# EAGLE schematic FED_detector_motor (EAGLE 5.11)
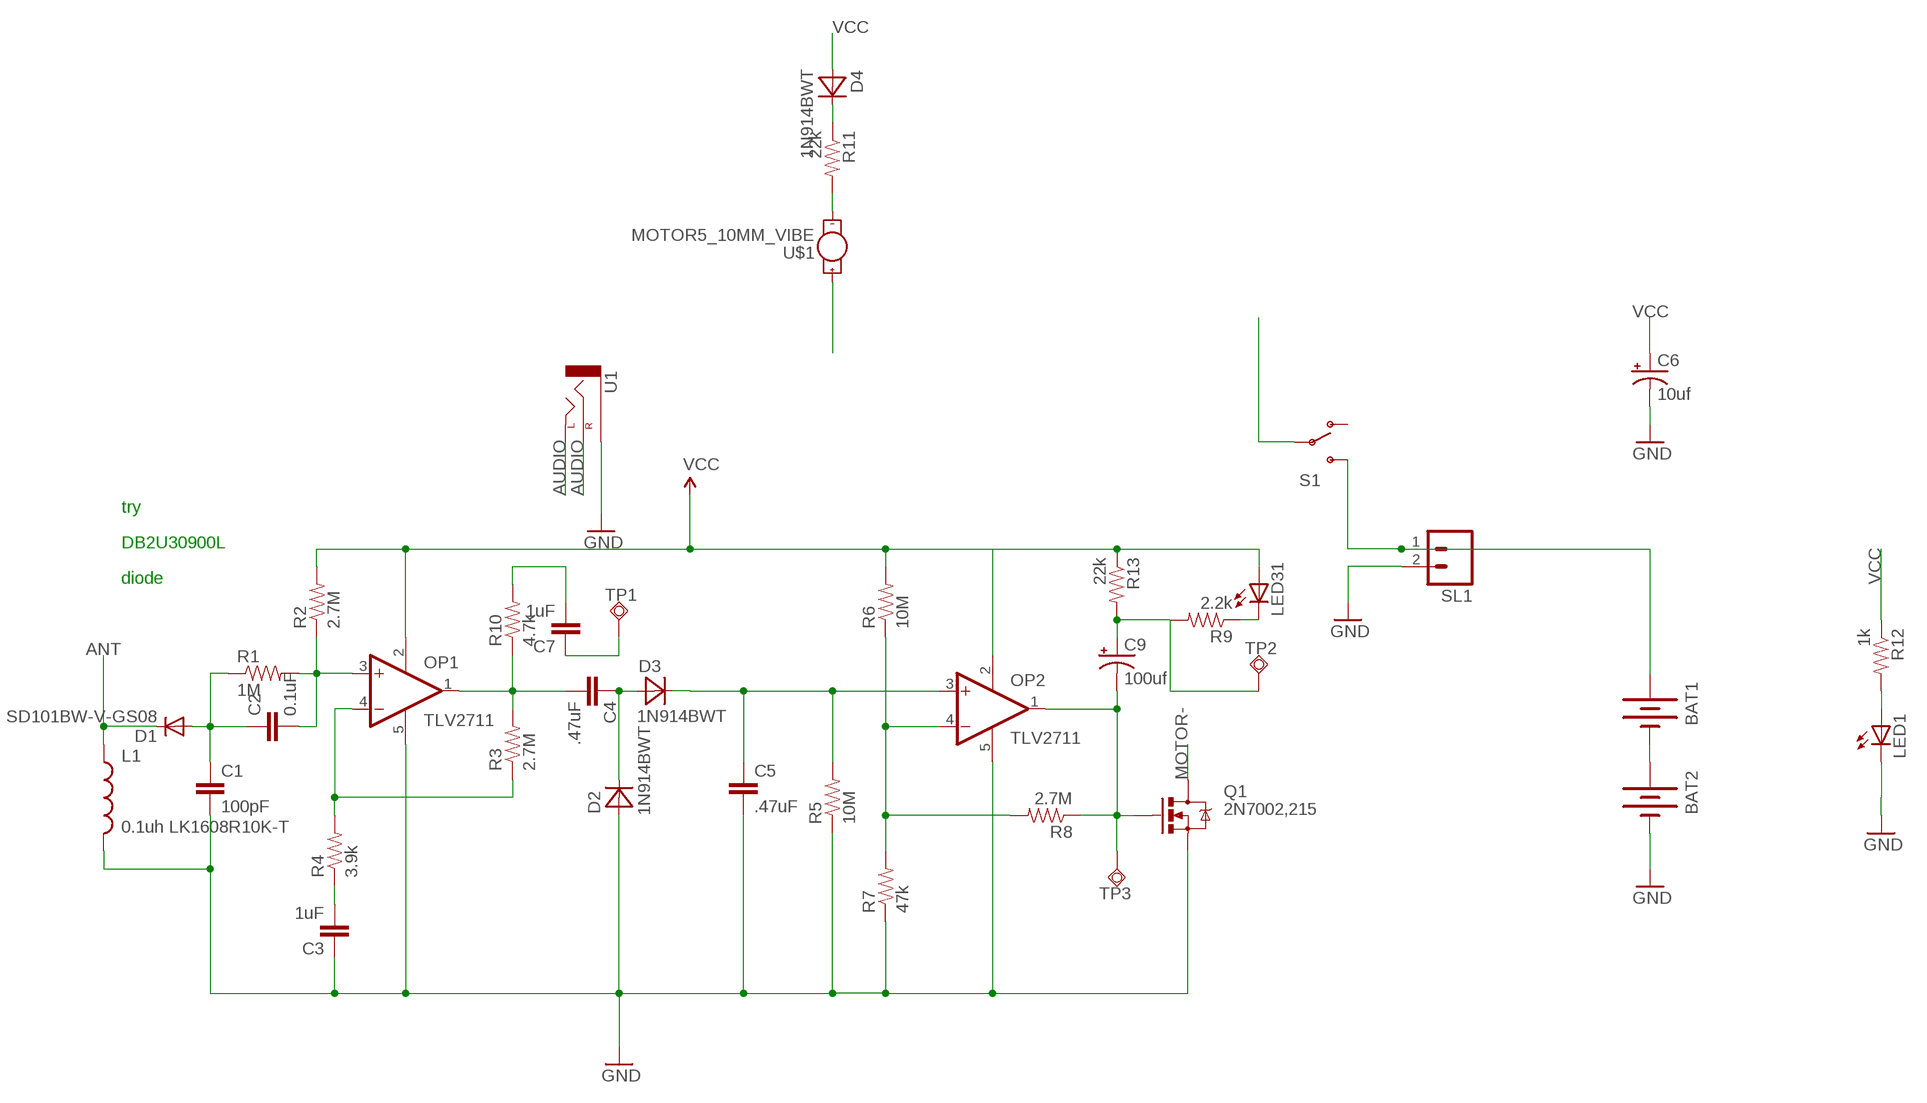
[diagram p0: schematic, sheet 1]

## Parts
BAT1  BATTERY245MM  [BATTCON_245MM]
BAT2  BATTERY245MM  [BATTCON_245MM]
C1  100pF  CAP0805  [0805]
C2  0.1uF  CAP0805  [0805]
C3  1uF  CAP0805  [0805]
C4  .47uF  CAP0805  [0805]
C5  .47uF  CAP0805  [0805]
C6  10uf  CAP_POLD  [PANASONIC_D]
C7  1uF  CAP0805  [0805]
C9  100uf  CAP_POL7343  [EIA7343]
D1  SD101BW-V-GS08  DIODE-SOD123  [SOD123]
D2  1N914BWT  [SOD-523F]
D3  1N914BWT  [SOD-523F]
D4  1N914BWT  [SOD-523F]
L1  0.1uh LK1608R10K-T  INDUCTOR0603  [0603]
LED1  LEDCHIPLED_1206  [CHIPLED_1206]
LED31  LEDCHIPLED_1206  [CHIPLED_1206]
OP1  TLV2711  [SOT23-5]
OP2  TLV2711  [SOT23-5]
Q1  2N7002,215  MOSFET-NCHANNELSMD  [SOT23-3]
R1  1M  RESISTOR0805-RES  [0805]
R2  2.7M  RESISTOR0805-RES  [0805]
R3  2.7M  RESISTOR0805-RES  [0805]
R4  3.9k  RESISTOR0805-RES  [0805]
R5  10M  RESISTOR0805-RES  [0805]
R6  10M  RESISTOR0805-RES  [0805]
R7  47k  RESISTOR0805-RES  [0805]
R8  2.7M  RESISTOR0805-RES  [0805]
R9  2.2k  RESISTOR0805-RES  [0805]
R10  4.7k  RESISTOR0805-RES  [0805]
R11  22k  RESISTOR0805-RES  [0805]
R12  1k  RESISTOR0805-RES  [0805]
R13  22k  RESISTOR0805-RES  [0805]
S1  SWITCH-SPST-SMD-A  [SWITCH-SPST-SMD-A]
SL1  M02  [02P]
TP1  TPSQTP20SQ  [TP20SQ]
TP2  TPSQTP20SQ  [TP20SQ]
TP3  TPSQTP20SQ  [TP20SQ]
U1  AUDIO-JACKSMD2  [AUDIO-JACK-3.5MM-SMD]
U$1  MOTOR5_10MM_VIBE  [5X10MM_VIB_MOTOR]

## Nets
ANT: D1.C L1.1
AUDIO: C7.1 TP1.TP U1.RING(RIGHT) U1.TIP(LEFT)
GND: BAT2.2(-) C1.2 C3.1 C5.2 C6.- D2.2(A) L1.2 LED1.C OP1.5(V-) OP2.5(V-) Q1.2(S) R5.1 R7.1 SL1.2 U1.SLEEVE
MOTOR-: Q1.3(D) U$1.P$1(+)
N$1: C1.1 C2.1 D1.A R1.1
N$2: C4.1 D2.1(C) D3.2(A)
N$3: C9.A(+) R9.2 R13.2 TP2.TP
N$4: C2.2 OP1.3(+IN) R1.2 R2.1
N$5: C5.1 D3.1(C) OP2.3(+IN) R5.2
N$6: C7.2 R10.2
N$7: OP1.4(-IN) R3.1 R4.2
N$8: C4.2 OP1.1(OUT) R3.2 R10.1
N$9: C3.2 R4.1
N$10: OP2.4(-IN) R6.1 R7.2 R8.2
N$12: D4.1(C) R11.1
N$13: C9.C(-) OP2.1(OUT) Q1.1(G) R8.1 TP3.TP
N$14: LED31.C R9.1
N$19: R11.2 U$1.P$2(-)
N$20: BAT1.2(-) BAT2.1(+)
N$21: BAT1.1(+) S1.3(S) SL1.1
N$24: LED1.A R12.2
VCC: C6.+ D4.2(A) LED31.A OP1.2(V+) OP2.2(V+) R2.2 R6.2 R12.1 R13.1 S1.2(P)
Unconnected: S1.1(O)

## Notes on the sheet
- try
- DB2U30900L
- diode

## Library data of the parts
BAT1 BAT2 = SparkFun:BATTERY: Battery Holders Various common sizes : AA, AAA, 20mm coin cell and 12mm coin cell.
C1-C5 C7 = SparkFun:CAP: Capacitor Standard 0603 ceramic capacitor, and 0.1" leaded capacitor.
C6 C9 = SparkFun:CAP_POL: Capacitor Polarized These are standard SMD and PTH capacitors. Normally 10uF, 47uF, and 100uF in electrolytic and tantalum varieties. Always verify the external diameter of the through hole cap, it varies with capacity, voltage, and manufacturer. The EIA devices should be standard.
D1 = diode:DIODE-: DIODE
D2-D4 = FED_detector:1N914BWT
L1 = SparkFun:INDUCTOR: Inductors Basic Inductor/Choke - 0603 and 1206. Footprints are not proven and vary greatly between part numbers.
LED1 LED31 = FED_detector:LED: LED OSRAM: - CHIPLED LG R971, LG N971, LY N971, LG Q971, LY Q971, LO R971, LY R971 LH N974, LH R974 LS Q976, LO Q976, LY Q976 LO Q996 - Hyper CHIPLED LW Q18S LB Q993, LB Q99A, LB R99A - SideLED LS A670, LO A670, LY A670, LG A670, LP A670 LB A673, LV A673, LT A673, LW A673 LH A674 LY A675 LS A676, LA A676, LO A676, LY A676, LW A676 LS A679, LY A679, LG A679 - Hyper Micro SIDELED® LS Y876, LA Y876, LO Y876, LY Y876 LT Y87S - SmartLED LW L88C, LW L88S LB L89C, LB L89S, LG L890 LS L89K, LO L89K, LY L89K LS L896, LA L896, LO L896, LY L896 - TOPLED LS T670, LO T670, LY T670, LG T670, LP T670 LSG T670, LSP T670, LSY T670, LOP T670, LYG T670 LG T671, LOG T671, LSG T671 LB T673, LV T673, LT T673, LW T673 LH T674 LS T676, LA T676, LO T676, LY T676, LB T676, LH T676, LSB T676, LW T676 LB T67C, LV T67C, LT T67C, LS T67K, LO T67K, LY T67K, LW E67C LS E67B, LA E67B, LO E67B, LY E67B, LB E67C, LV E67C, LT E67C LW T67C LS T679, LY T679, LG T679 LS T770, LO T770, LY T770, LG T770, LP T770 LB T773, LV T773, LT T773, LW T773 LH T774 LS E675, LA E675, LY E675, LS T675 LS T776, LA T776, LO T776, LY T776, LB T776 LHGB T686 LT T68C, LB T68C - Hyper Mini TOPLED® LB M676 - Mini TOPLED Santana® LG M470 LS M47K, LO M47K, LY M47K Source: http://www.osram.convergy.de LUXEON: - LUMILED® LXK2-PW12-R00, LXK2-PW12-S00, LXK2-PW14-U00, LXK2-PW14-V00 LXK2-PM12-R00, LXK2-PM12-S00, LXK2-PM14-U00 LXK2-PE12-Q00, LXK2-PE12-R00, LXK2-PE12-S00, LXK2-PE14-T00, LXK2-PE14-U00 LXK2-PB12-K00, LXK2-PB12-L00, LXK2-PB12-M00, LXK2-PB14-N00, LXK2-PB14-P00, LXK2-PB14-Q00 LXK2-PR12-L00, LXK2-PR12-M00, LXK2-PR14-Q00, LXK2-PR14-R00 LXK2-PD12-Q00, LXK2-PD12-R00, LXK2-PD12-S00 LXK2-PH12-R00, LXK2-PH12-S00 LXK2-PL12-P00, LXK2-PL12-Q00, LXK2-PL12-R00 Source: www.luxeon.com KINGBRIGHT: KA-3528ASYC Source: www.kingbright.com
OP1 OP2 = FED_detector:TLV2711
Q1 = SparkFun:MOSFET-NCHANNEL
R1-R13 = SparkFun:RESISTOR: Resistor Basic schematic elements and footprints for 0603, 1206, and PTH resistors.
S1 = SparkFun:SWITCH-SPST: SPST Switch Simple slide switch. Spark Fun Electronics SKU : COM-00102
SL1 = PWM:M02: AMP QUICK CONNECTOR; OC_FARNELL: unknown; OC_NEWARK: unknown
TP1-TP3 = testpad:TPSQ: Test pad
U1 = SparkFun:AUDIO-JACK: 3.5mm Audio Jack Simple 3.5mm common PCB mount audio jack. SKU: PRT-08032
U$1 = FED_detector_motor:MOTOR: Vibration Motor Physical dimension and wire connections for this powerful vibration motor. Motor has a self adhesive backing. Spark Fun Electronics SKU : ROB-08449